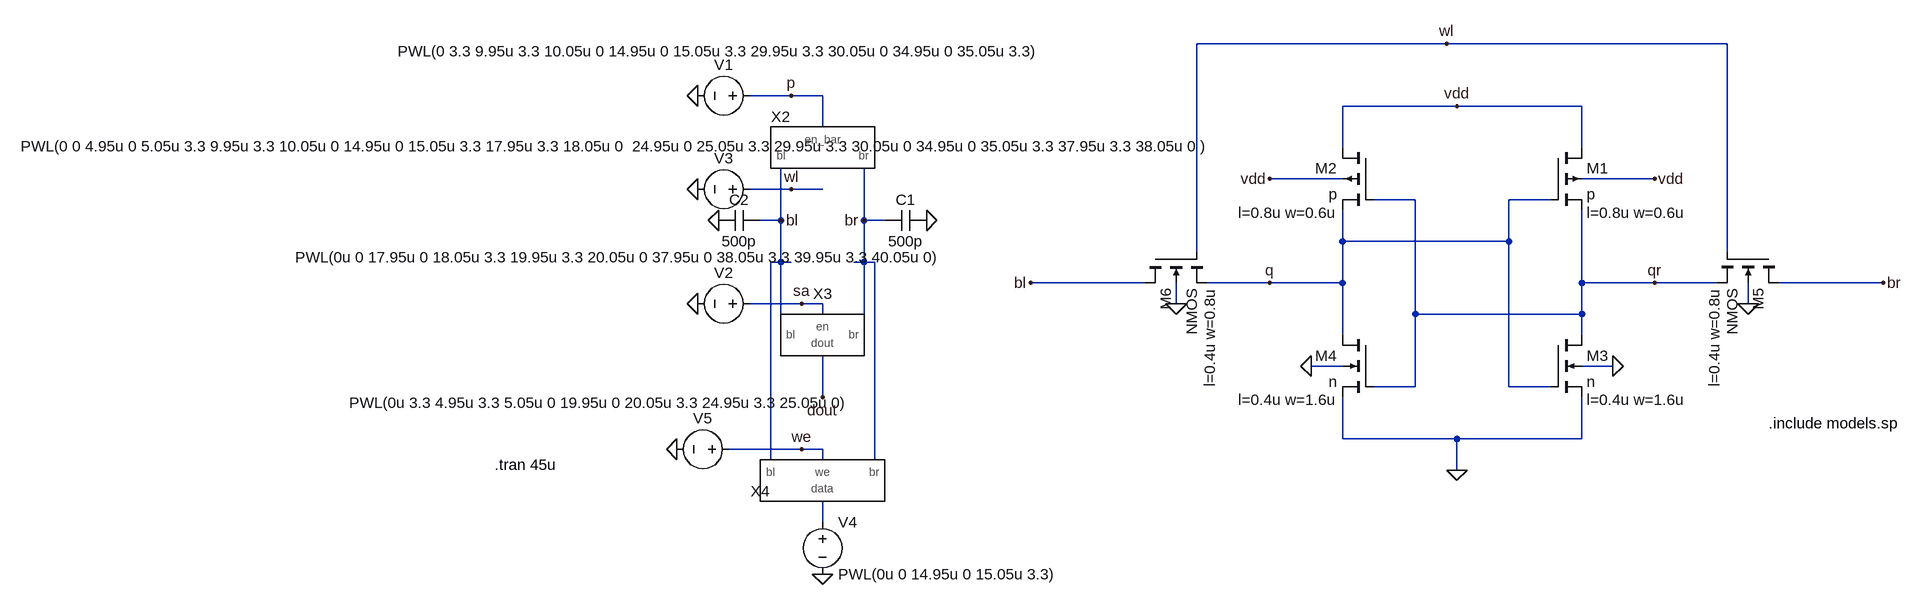
[diagram p0: schematic _test_cell.asc]
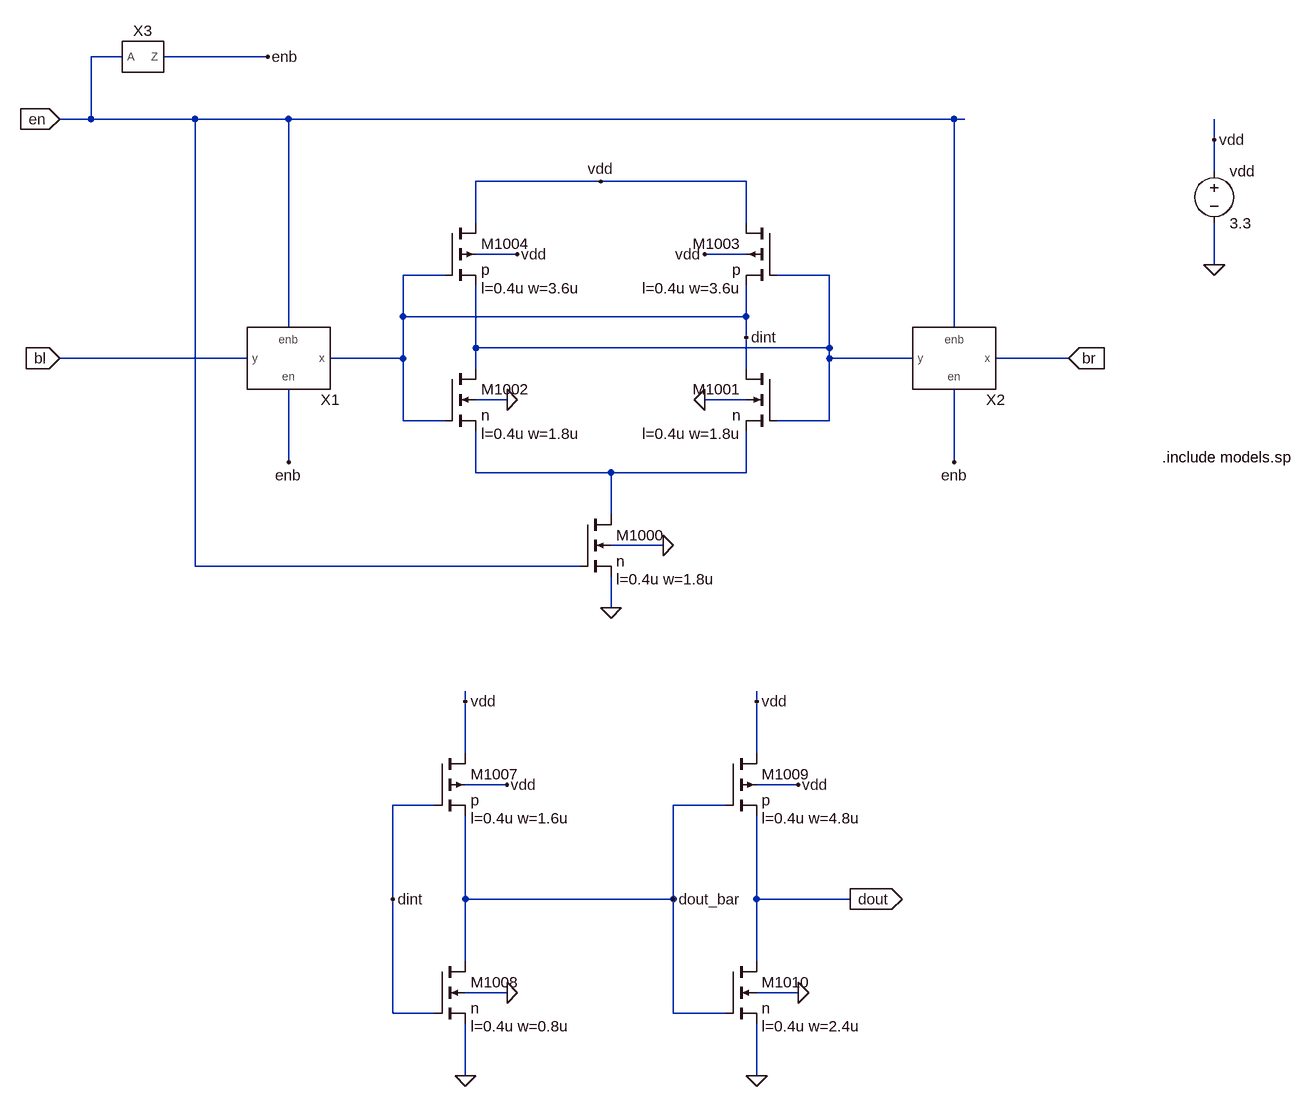
[diagram p1: sub-circuit sense_amp.asc]
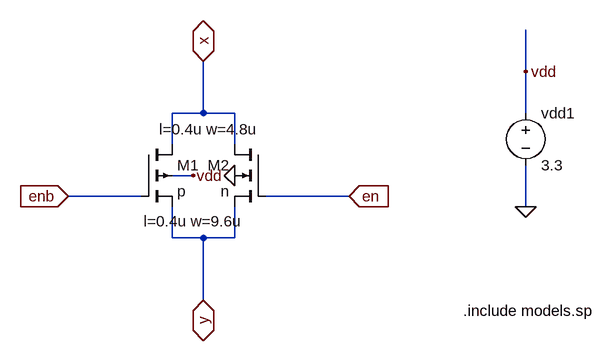
[diagram p2: sub-circuit tri_gate.asc]
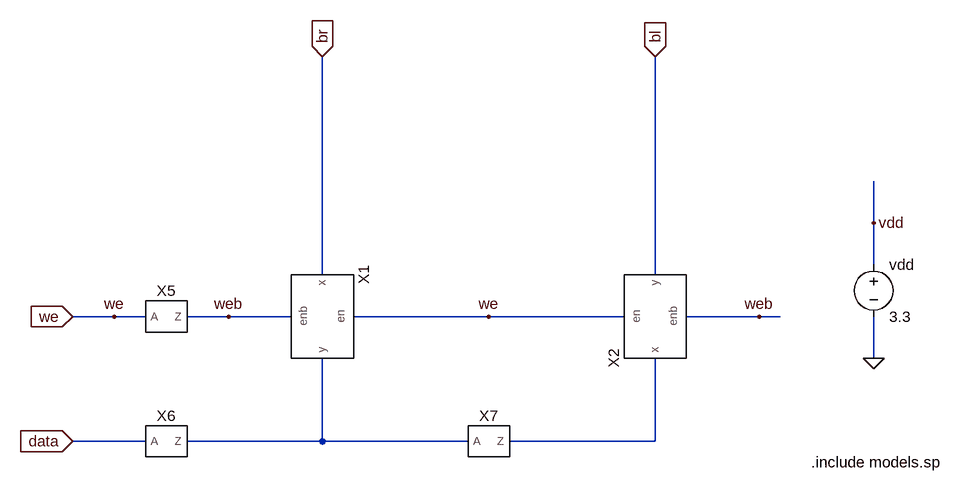
[diagram p3: sub-circuit write_driver.asc]
_test_cell.asc, the LTspice schematic file:
Version 4
SHEET 1 1844 680
WIRE 1088 -176 704 -176
WIRE 1520 -176 1088 -176
WIRE 80 -96 16 -96
WIRE 128 -96 80 -96
WIRE 1104 -80 928 -80
WIRE 1296 -80 1104 -80
WIRE 128 -48 128 -96
WIRE 928 -16 928 -80
WIRE 1296 -16 1296 -80
WIRE 928 32 816 32
WIRE 1408 32 1296 32
WIRE 80 48 16 48
WIRE 128 48 80 48
WIRE 1040 64 976 64
WIRE 1248 64 1184 64
WIRE 64 96 64 16
WIRE 64 96 32 96
WIRE 192 96 192 16
WIRE 224 96 192 96
WIRE 928 128 928 80
WIRE 1184 128 1184 64
WIRE 1184 128 928 128
WIRE 704 144 704 -176
WIRE 1520 144 1520 -176
WIRE 64 160 64 96
WIRE 64 160 48 160
WIRE 80 160 64 160
WIRE 192 160 192 96
WIRE 192 160 176 160
WIRE 208 160 192 160
WIRE 624 192 448 192
WIRE 816 192 720 192
WIRE 928 192 928 128
WIRE 928 192 816 192
WIRE 1296 192 1296 80
WIRE 1408 192 1296 192
WIRE 1504 192 1408 192
WIRE 1760 192 1600 192
WIRE 96 224 16 224
WIRE 128 224 96 224
WIRE 672 224 672 192
WIRE 1552 224 1552 192
WIRE 128 240 128 224
WIRE 1040 240 1040 64
WIRE 1296 240 1296 192
WIRE 1296 240 1040 240
WIRE 64 272 64 160
WIRE 192 272 192 160
WIRE 928 272 928 192
WIRE 1296 272 1296 240
WIRE 928 320 880 320
WIRE 1344 320 1296 320
WIRE 1040 352 1040 240
WIRE 1040 352 976 352
WIRE 1184 352 1184 128
WIRE 1248 352 1184 352
WIRE 128 368 128 304
WIRE 928 432 928 368
WIRE 1104 432 928 432
WIRE 1296 432 1296 368
WIRE 1296 432 1104 432
WIRE 96 448 -16 448
WIRE 128 448 96 448
WIRE 48 464 48 160
WIRE 128 464 128 448
WIRE 208 464 208 160
WIRE 1104 480 1104 432
WIRE 128 560 128 528
FLAG -64 48 0
FLAG 288 96 0
FLAG -32 96 0
FLAG 64 96 bl
FLAG 192 96 br
FLAG 128 368 dout
FLAG -64 -96 0
FLAG -64 224 0
FLAG 128 640 0
FLAG -96 448 0
FLAG 96 224 sa
FLAG 80 -96 p
FLAG 80 48 wl
FLAG 96 448 we
FLAG 1104 480 0
FLAG 1104 -80 vdd
FLAG 1344 320 0
FLAG 880 320 0
FLAG 1552 224 0
FLAG 672 224 0
FLAG 816 32 vdd
FLAG 1408 32 vdd
FLAG 448 192 bl
FLAG 1088 -176 wl
FLAG 1760 192 br
FLAG 816 192 q
FLAG 1408 192 qr
SYMBOL voltage 32 48 R90
WINDOW 0 -32 56 VBottom 2
WINDOW 3 -82 209 VTop 2
SYMATTR InstName V3
SYMATTR Value PWL(0 0 4.95u 0 5.05u 3.3 9.95u 3.3 10.05u 0 14.95u 0 15.05u 3.3 17.95u 3.3 18.05u 0  24.95u 0 25.05u 3.3 29.95u 3.3 30.05u 0 34.95u 0 35.05u 3.3 37.95u 3.3 38.05u 0 )
SYMBOL precharge 128 -16 R0
SYMATTR InstName X2
SYMBOL cap 224 112 R270
WINDOW 0 32 32 VTop 2
WINDOW 3 0 32 VBottom 2
SYMATTR InstName C1
SYMATTR Value 500p
SYMBOL cap 32 80 R90
WINDOW 0 0 32 VBottom 2
WINDOW 3 32 32 VTop 2
SYMATTR InstName C2
SYMATTR Value 500p
SYMBOL sense_amp 128 288 R0
SYMATTR InstName X3
SYMBOL voltage 32 -96 R90
WINDOW 0 -32 56 VBottom 2
WINDOW 3 -84 58 VTop 2
WINDOW 123 0 0 Left 0
WINDOW 39 0 0 Left 0
SYMATTR InstName V1
SYMATTR Value PWL(0 3.3 9.95u 3.3 10.05u 0 14.95u 0 15.05u 3.3 29.95u 3.3 30.05u 0 34.95u 0 35.05u 3.3)
SYMBOL voltage 32 224 R90
WINDOW 0 -32 56 VBottom 2
WINDOW 3 -87 212 VTop 2
WINDOW 123 0 0 Left 0
WINDOW 39 0 0 Left 0
SYMATTR InstName V2
SYMATTR Value PWL(0u 0 17.95u 0 18.05u 3.3 19.95u 3.3 20.05u 0 37.95u 0 38.05u 3.3 39.95u 3.3 40.05u 0)
SYMBOL write_driver 128 496 R0
SYMATTR InstName X4
SYMBOL voltage 128 544 R0
WINDOW 123 0 0 Left 0
WINDOW 39 0 0 Left 0
SYMATTR InstName V4
SYMATTR Value PWL(0u 0 14.95u 0 15.05u 3.3)
SYMBOL voltage 0 448 R90
WINDOW 0 -32 56 VBottom 2
WINDOW 3 -87 212 VTop 2
WINDOW 123 0 0 Left 0
WINDOW 39 0 0 Left 0
SYMATTR InstName V5
SYMATTR Value PWL(0u 3.3 4.95u 3.3 5.05u 0 19.95u 0 20.05u 3.3 24.95u 3.3 25.05u 0)
SYMBOL pmos4 1248 -16 R0
WINDOW 123 56 100 Left 2
SYMATTR Value2 l=0.8u w=0.6u
SYMATTR InstName M1
SYMATTR Value p
SYMBOL pmos4 976 -16 M0
WINDOW 123 56 100 Left 2
SYMATTR Value2 l=0.8u w=0.6u
SYMATTR InstName M2
SYMATTR Value p
SYMBOL nmos4 1248 272 R0
WINDOW 123 56 100 Left 2
SYMATTR Value2 l=0.4u w=1.6u
SYMATTR InstName M3
SYMATTR Value n
SYMBOL nmos4 976 272 M0
WINDOW 123 56 100 Left 2
SYMATTR Value2 l=0.4u w=1.6u
SYMATTR InstName M4
SYMATTR Value n
SYMBOL nmos4 1600 144 R90
WINDOW 123 56 100 Left 2
SYMATTR Value2 l=0.4u w=0.8u
SYMATTR InstName M5
SYMBOL nmos4 624 144 M90
WINDOW 123 56 100 Left 2
SYMATTR Value2 l=0.4u w=0.8u
SYMATTR InstName M6
TEXT -376 472 Left 2 !.tran 45u
TEXT 1584 408 Left 2 !.include models.sp

sense_amp.asc, the sub-circuit schematic file:
Version 4
SHEET 1 2104 2356
WIRE -2240 768 -2288 768
WIRE -2016 768 -2176 768
WIRE -2288 864 -2288 768
WIRE -2288 864 -2336 864
WIRE -2128 864 -2288 864
WIRE -1984 864 -2128 864
WIRE -960 864 -1984 864
WIRE -944 864 -960 864
WIRE -560 896 -560 864
WIRE -560 944 -560 896
WIRE -1504 960 -1696 960
WIRE -1280 960 -1504 960
WIRE -1696 1024 -1696 960
WIRE -1280 1024 -1280 960
WIRE -1632 1072 -1696 1072
WIRE -1280 1072 -1344 1072
WIRE -560 1088 -560 1024
WIRE -1744 1104 -1808 1104
WIRE -1152 1104 -1232 1104
WIRE -1808 1168 -1808 1104
WIRE -1280 1168 -1280 1120
WIRE -1280 1168 -1808 1168
WIRE -1984 1184 -1984 864
WIRE -960 1184 -960 864
WIRE -1280 1200 -1280 1168
WIRE -1696 1216 -1696 1120
WIRE -1152 1216 -1152 1104
WIRE -1152 1216 -1696 1216
WIRE -2048 1232 -2336 1232
WIRE -1808 1232 -1808 1168
WIRE -1808 1232 -1920 1232
WIRE -1152 1232 -1152 1216
WIRE -1024 1232 -1152 1232
WIRE -784 1232 -896 1232
WIRE -1696 1248 -1696 1216
WIRE -1280 1248 -1280 1200
WIRE -1648 1296 -1696 1296
WIRE -1280 1296 -1344 1296
WIRE -1808 1328 -1808 1232
WIRE -1744 1328 -1808 1328
WIRE -1152 1328 -1152 1232
WIRE -1152 1328 -1232 1328
WIRE -1984 1392 -1984 1280
WIRE -960 1392 -960 1280
WIRE -1696 1408 -1696 1344
WIRE -1488 1408 -1696 1408
WIRE -1280 1408 -1280 1344
WIRE -1280 1408 -1488 1408
WIRE -1488 1472 -1488 1408
WIRE -1408 1520 -1488 1520
WIRE -2128 1552 -2128 864
WIRE -1536 1552 -2128 1552
WIRE -1488 1616 -1488 1568
WIRE -1712 1760 -1712 1744
WIRE -1264 1760 -1264 1744
WIRE -1712 1840 -1712 1760
WIRE -1264 1840 -1264 1760
WIRE -1648 1888 -1712 1888
WIRE -1200 1888 -1264 1888
WIRE -1760 1920 -1824 1920
WIRE -1312 1920 -1392 1920
WIRE -1824 2064 -1824 1920
WIRE -1712 2064 -1712 1936
WIRE -1392 2064 -1392 1920
WIRE -1392 2064 -1712 2064
WIRE -1264 2064 -1264 1936
WIRE -1120 2064 -1264 2064
WIRE -1712 2160 -1712 2064
WIRE -1264 2160 -1264 2064
WIRE -1648 2208 -1712 2208
WIRE -1200 2208 -1264 2208
WIRE -1824 2240 -1824 2064
WIRE -1760 2240 -1824 2240
WIRE -1392 2240 -1392 2064
WIRE -1312 2240 -1392 2240
WIRE -1712 2336 -1712 2256
WIRE -1264 2336 -1264 2256
FLAG -1712 2336 0
FLAG -560 1088 0
FLAG -560 896 vdd
FLAG -1264 1760 vdd
FLAG -1712 1760 vdd
FLAG -1824 2064 dint
FLAG -1392 2064 dout_bar
FLAG -1264 2336 0
FLAG -1120 2064 dout
IOPIN -1120 2064 Out
FLAG -1488 1616 0
FLAG -1280 1200 dint
FLAG -1504 960 vdd
FLAG -1648 2208 0
FLAG -1200 2208 0
FLAG -1344 1296 0
FLAG -1648 1296 0
FLAG -1408 1520 0
FLAG -1632 1072 vdd
FLAG -1344 1072 vdd
FLAG -1200 1888 vdd
FLAG -1648 1888 vdd
FLAG -2336 864 en
IOPIN -2336 864 In
FLAG -2336 1232 bl
IOPIN -2336 1232 In
FLAG -784 1232 br
IOPIN -784 1232 In
FLAG -2016 768 enb
FLAG -960 1392 enb
FLAG -1984 1392 enb
SYMBOL nmos4 -1536 1472 R0
WINDOW 123 56 100 Left 2
SYMATTR Value2 l=0.4u w=1.8u
SYMATTR InstName M1000
SYMATTR Value n
SYMBOL nmos4 -1232 1248 M0
WINDOW 123 56 100 Left 2
SYMATTR Value2 l=0.4u w=1.8u
SYMATTR InstName M1001
SYMATTR Value n
SYMBOL nmos4 -1744 1248 R0
WINDOW 123 56 100 Left 2
SYMATTR Value2 l=0.4u w=1.8u
SYMATTR InstName M1002
SYMATTR Value n
SYMBOL nmos4 -1760 2160 R0
WINDOW 123 56 100 Left 2
SYMATTR Value2 l=0.4u w=0.8u
SYMATTR InstName M1008
SYMATTR Value n
SYMBOL nmos4 -1312 2160 R0
WINDOW 123 56 100 Left 2
SYMATTR Value2 l=0.4u w=2.4u
SYMATTR InstName M1010
SYMATTR Value n
SYMBOL pmos4 -1232 1024 M0
WINDOW 123 56 100 Left 2
SYMATTR Value2 l=0.4u w=3.6u
SYMATTR InstName M1003
SYMATTR Value p
SYMBOL pmos4 -1744 1024 R0
WINDOW 123 56 100 Left 2
SYMATTR Value2 l=0.4u w=3.6u
SYMATTR InstName M1004
SYMATTR Value p
SYMBOL pmos4 -1312 1840 R0
WINDOW 123 56 100 Left 2
SYMATTR Value2 l=0.4u w=4.8u
SYMATTR InstName M1009
SYMATTR Value p
SYMBOL pmos4 -1760 1840 R0
WINDOW 123 56 100 Left 2
SYMATTR Value2 l=0.4u w=1.6u
SYMATTR InstName M1007
SYMATTR Value p
SYMBOL voltage -560 928 R0
SYMATTR InstName vdd
SYMATTR Value 3.3
SYMBOL tri_gate -1984 1232 R180
SYMATTR InstName X1
SYMBOL tri_gate -960 1232 R180
SYMATTR InstName X2
SYMBOL inv -2208 768 R0
SYMATTR InstName X3
TEXT -640 1384 Left 2 !.include models.sp

tri_gate.asc, the sub-circuit schematic file:
Version 4
SHEET 1 880 680
WIRE 576 -16 576 -80
WIRE 80 48 80 -32
WIRE 80 48 32 48
WIRE 128 48 80 48
WIRE 576 48 576 -16
WIRE 32 96 32 48
WIRE 128 96 128 48
WIRE 64 144 32 144
WIRE -16 176 -128 176
WIRE 304 176 176 176
WIRE 576 192 576 128
WIRE 32 240 32 192
WIRE 80 240 32 240
WIRE 128 240 128 192
WIRE 128 240 80 240
WIRE 80 336 80 240
FLAG 128 144 0
FLAG 64 144 vdd
FLAG 576 192 0
FLAG 576 -16 vdd
FLAG 80 336 y
IOPIN 80 336 BiDir
FLAG 80 -32 x
IOPIN 80 -32 BiDir
FLAG 304 176 en
IOPIN 304 176 In
FLAG -128 176 enb
IOPIN -128 176 In
SYMBOL pmos4 -16 96 R0
WINDOW 123 4 118 Left 2
SYMATTR Value2 l=0.4u w=9.6u
SYMATTR InstName M1
SYMATTR Value p
SYMBOL nmos4 176 96 M0
WINDOW 123 12 -23 Left 2
SYMATTR Value2 l=0.4u w=4.8u
SYMATTR InstName M2
SYMATTR Value n
SYMBOL voltage 576 32 R0
WINDOW 123 0 0 Left 0
WINDOW 39 0 0 Left 0
SYMATTR InstName vdd1
SYMATTR Value 3.3
TEXT 480 352 Left 2 !.include models.sp

write_driver.asc, the sub-circuit schematic file:
Version 4
SHEET 1 880 680
WIRE 624 -624 624 -688
WIRE 624 -560 624 -624
WIRE -224 -544 -224 -880
WIRE 288 -544 288 -880
WIRE -544 -480 -608 -480
WIRE -496 -480 -544 -480
WIRE -368 -480 -432 -480
WIRE -272 -480 -368 -480
WIRE 32 -480 -176 -480
WIRE 240 -480 32 -480
WIRE 448 -480 336 -480
WIRE 480 -480 448 -480
WIRE 624 -416 624 -480
WIRE -496 -288 -608 -288
WIRE -224 -288 -224 -416
WIRE -224 -288 -432 -288
WIRE 0 -288 -224 -288
WIRE 288 -288 288 -416
WIRE 288 -288 64 -288
FLAG 624 -416 0
FLAG 624 -624 vdd
FLAG -608 -480 we
IOPIN -608 -480 In
FLAG -608 -288 data
IOPIN -608 -288 In
FLAG -224 -880 br
IOPIN -224 -880 In
FLAG 288 -880 bl
IOPIN 288 -880 In
FLAG -368 -480 web
FLAG 32 -480 we
FLAG -544 -480 we
FLAG 448 -480 web
SYMBOL voltage 624 -576 R0
WINDOW 123 0 0 Left 0
WINDOW 39 0 0 Left 0
SYMATTR InstName vdd
SYMATTR Value 3.3
SYMBOL inv -464 -480 R0
SYMATTR InstName X5
SYMBOL inv -464 -288 R0
SYMATTR InstName X6
SYMBOL inv 32 -288 R0
SYMATTR InstName X7
SYMBOL tri_gate -224 -480 R90
SYMATTR InstName X1
SYMBOL tri_gate 288 -480 R270
SYMATTR InstName X2
TEXT 528 -256 Left 2 !.include models.sp

The netlist it stands for:
* _test_cell.asc
V3 wl 0 PWL(0 0 4.95u 0 5.05u 3.3 9.95u 3.3 10.05u 0 14.95u 0 15.05u 3.3 17.95u 3.3 18.05u 0  24.95u 0 25.05u 3.3 29.95u 3.3 30.05u 0 34.95u 0 35.05u 3.3 37.95u 3.3 38.05u 0 )
XX2 p bl br precharge  ; pins en_bar bl br
C1 br 0 500p
C2 bl 0 500p
XX3 bl br sa dout sense_amp
V1 p 0 PWL(0 3.3 9.95u 3.3 10.05u 0 14.95u 0 15.05u 3.3 29.95u 3.3 30.05u 0 34.95u 0 35.05u 3.3)
V2 sa 0 PWL(0u 0 17.95u 0 18.05u 3.3 19.95u 3.3 20.05u 0 37.95u 0 38.05u 3.3 39.95u 3.3 40.05u 0)
XX4 bl br N001 we write_driver
V4 N001 0 PWL(0u 0 14.95u 0 15.05u 3.3)
V5 we 0 PWL(0u 3.3 4.95u 3.3 5.05u 0 19.95u 0 20.05u 3.3 24.95u 3.3 25.05u 0)
M1 vdd q qr vdd p l=0.8u w=0.6u
M2 vdd qr q vdd p l=0.8u w=0.6u
M3 qr q 0 0 n l=0.4u w=1.6u
M4 q qr 0 0 n l=0.4u w=1.6u
M5 br wl qr 0 NMOS l=0.4u w=0.8u
M6 bl wl q 0 NMOS l=0.4u w=0.8u

* block symbol definitions
.subckt sense_amp bl br en dout
M1000 N002 en 0 0 n l=0.4u w=1.8u
M1001 dint N001 N002 0 n l=0.4u w=1.8u
M1002 N001 dint N002 0 n l=0.4u w=1.8u
M1008 dout_bar dint 0 0 n l=0.4u w=0.8u
M1010 dout dout_bar 0 0 n l=0.4u w=2.4u
M1003 vdd N001 dint vdd p l=0.4u w=3.6u
M1004 vdd dint N001 vdd p l=0.4u w=3.6u
M1009 vdd dout_bar dout vdd p l=0.4u w=4.8u
M1007 vdd dint dout_bar vdd p l=0.4u w=1.6u
vdd vdd 0 3.3
XX1 enb en dint bl tri_gate
XX2 enb en br N001 tri_gate
XX3 en enb inv  ; pins A Z
.include models.sp
.ends sense_amp

.subckt tri_gate en enb x y
M1 x enb y vdd p l=0.4u w=9.6u
M2 x en y 0 n l=0.4u w=4.8u
vdd1 vdd 0 3.3
.include models.sp
.ends tri_gate

.subckt write_driver bl br data we
vdd vdd 0 3.3
XX5 we web inv  ; pins A Z
XX6 data N001 inv  ; pins A Z
XX7 N001 N002 inv  ; pins A Z
XX1 we web br N001 tri_gate
XX2 we web N002 bl tri_gate
.include models.sp
.ends write_driver

.model NMOS NMOS
.model PMOS PMOS
.lib standard.mos
.tran 45u
.include models.sp
.backanno
.end